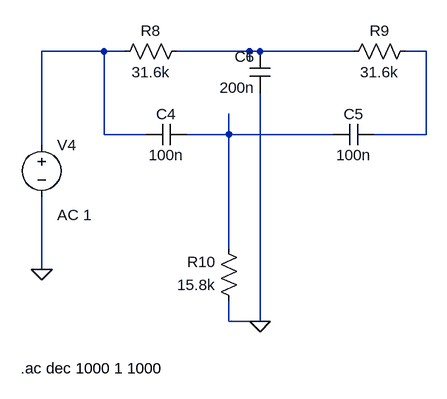
[diagram p0: schematic Notch_50Hz.asc]
Notch_50Hz.asc, the LTspice schematic file:
Version 4.1
SHEET 1 1316 1348
WIRE -144 736 -240 736
WIRE -112 736 -144 736
WIRE 80 736 -32 736
WIRE 96 736 80 736
WIRE 240 736 96 736
WIRE 352 736 320 736
WIRE 80 752 80 736
WIRE -144 864 -144 736
WIRE -80 864 -144 864
WIRE 48 864 48 832
WIRE 48 864 -16 864
WIRE 208 864 48 864
WIRE 352 864 352 736
WIRE 352 864 272 864
WIRE -240 880 -240 736
WIRE 48 1040 48 864
WIRE -240 1072 -240 960
WIRE 48 1152 48 1120
WIRE 96 1152 96 800
WIRE 96 1152 48 1152
FLAG -240 1072 0
FLAG 96 1152 0
SYMBOL voltage -240 864 R0
WINDOW 123 24 124 Left 2
WINDOW 39 0 0 Left 0
SYMATTR InstName V4
SYMATTR Value ""
SYMATTR Value2 AC 1
SYMBOL res -16 720 R90
WINDOW 0 0 56 VBottom 2
WINDOW 3 32 56 VTop 2
SYMATTR InstName R8
SYMATTR Value 31.6k
SYMBOL res 336 720 R90
WINDOW 0 0 56 VBottom 2
WINDOW 3 32 56 VTop 2
SYMATTR InstName R9
SYMATTR Value 31.6k
SYMBOL res 64 1136 R180
WINDOW 0 36 76 Left 2
WINDOW 3 36 40 Left 2
SYMATTR InstName R10
SYMATTR Value 15.8k
SYMBOL cap -16 848 R90
WINDOW 0 0 32 VBottom 2
WINDOW 3 32 32 VTop 2
SYMATTR InstName C4
SYMATTR Value 100n
SYMBOL cap 272 848 R90
WINDOW 0 0 32 VBottom 2
WINDOW 3 32 32 VTop 2
SYMATTR InstName C5
SYMATTR Value 100n
SYMBOL cap 112 800 R180
WINDOW 0 24 56 Left 2
WINDOW 3 24 8 Left 2
SYMATTR InstName C6
SYMATTR Value 200n
TEXT -272 1224 Left 2 !.ac dec 1000 1 1000

The netlist it stands for:
* Notch_50Hz.asc
V4 N001 0 AC 1
R8 N002 N001 31.6k
R9 N003 N002 31.6k
R10 0 N004 15.8k
C4 N004 N001 100n
C5 N003 N004 100n
C6 0 N002 200n
.ac dec 1000 1 1000
.backanno
.end